# Altium schematic sheet MAIN_SCH.SchDoc
size A; SheetNumber: 1; SheetTotal: 3
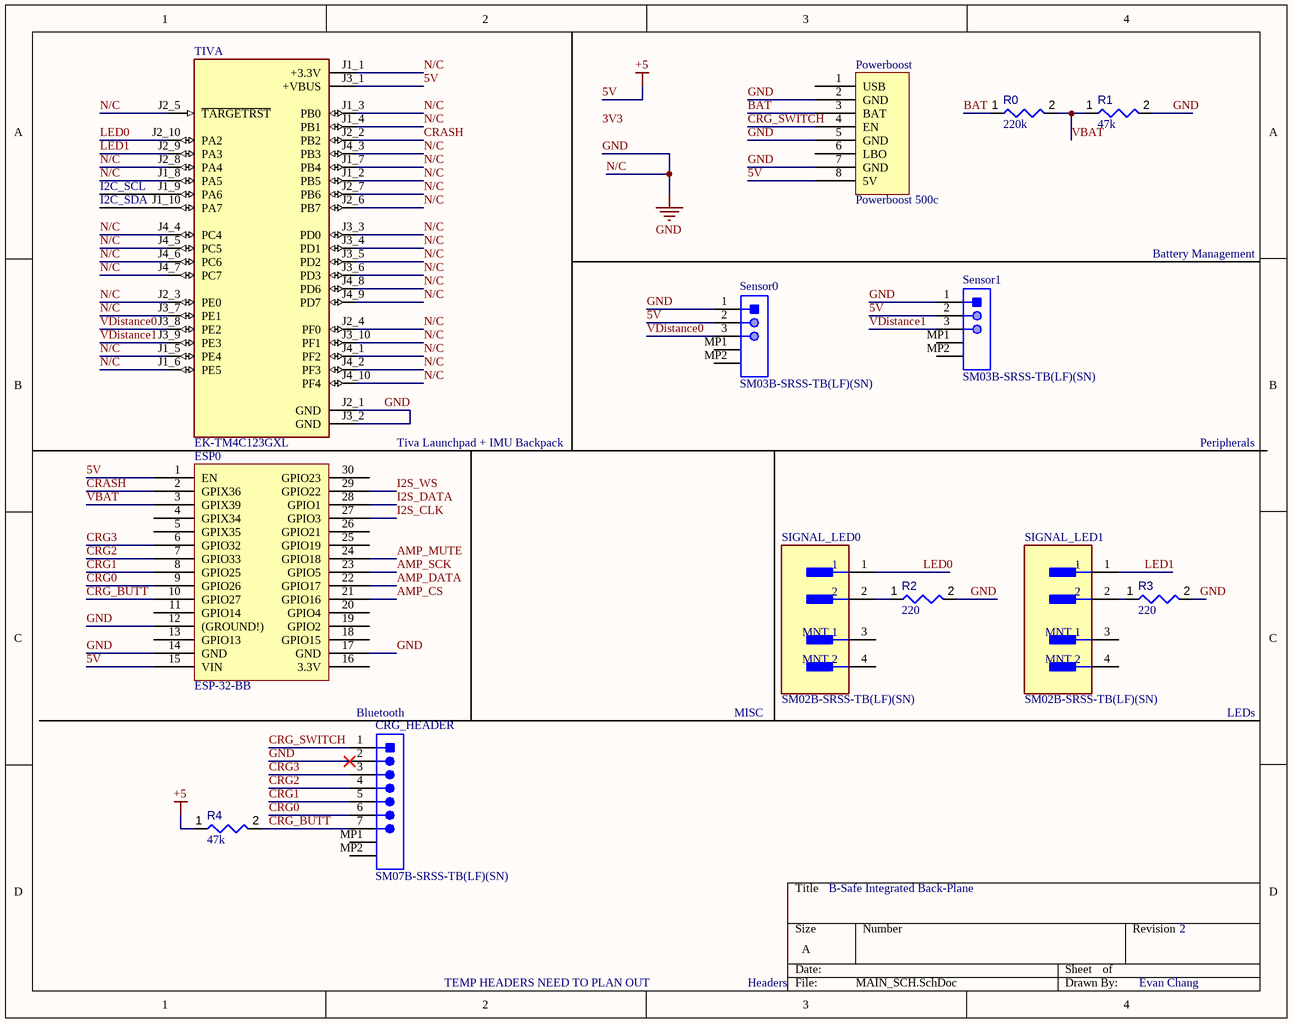
[diagram p0: MAIN_SCH.SchDoc]

## Parts
CRG_HEADER  SM07B-SRSS-TB(LF)(SN)  [JST-SM07B-SRSS-TB_V]
ESP0  ESP-32-BB  [ESP-32-BB-Footprint-1]
Powerboost  Powerboost 500c  [Powerboost 500c-Footprint-1]
R0  value 220k  [RESC1005X40X25NL05T10]  (hidden comment: RC0402FR-07220KL)
R1  value 47k  [RESC1005X40X25NL05T10]  (hidden comment: RC0402FR-0747KL)
R2  value 220  [RESC1608X55X30LL20T10]  (hidden comment: RK73B1JTTD221J)
R3  value 220  [RESC1608X55X30LL20T10]  (hidden comment: RK73B1JTTD221J)
R4  value 47k  [RESC1005X40X25NL05T10]  (hidden comment: RC0402FR-0747KL)
Sensor0  SM03B-SRSS-TB(LF)(SN)  [JST-SM03B-SRSS-TB_V]
Sensor1  SM03B-SRSS-TB(LF)(SN)  [JST-SM03B-SRSS-TB_V]
SIGNAL_LED0  SM02B-SRSS-TB(LF)(SN)  [FP-SM02B-SRSS-TB_LF_SN-0]
SIGNAL_LED1  SM02B-SRSS-TB(LF)(SN)  [FP-SM02B-SRSS-TB_LF_SN-0]
TIVA  EK-TM4C123GXL  [EK-TM4C123GXL-Footprint-1]

## Nets
5V: ESP0.1(EN) ESP0.15(VIN) Powerboost.8(5V) R4.1 Sensor0.2 Sensor1.2 TIVA.J3_1(+VBUS)  [also labelled +5]
GND: CRG_HEADER.2 ESP0.12((GROUND!)) ESP0.14(GND) ESP0.17(GND) Powerboost.2(GND) Powerboost.5(GND) Powerboost.7(GND) R1.2 R2.2 R3.2 Sensor0.1 Sensor1.1 TIVA.J1_1(+3.3V) TIVA.J1_2(PB5) TIVA.J1_3(PB0) TIVA.J1_4(PB1) TIVA.J1_5(PE4) TIVA.J1_6(PE5) TIVA.J1_7(PB4) TIVA.J1_8(PA5) TIVA.J2_1(GND) TIVA.J2_3(PE0) TIVA.J2_4(PF0) TIVA.J2_5(~{TARGETRST}) TIVA.J2_6(PB7) TIVA.J2_7(PB6) TIVA.J2_8(PA4) TIVA.J3_2(GND) TIVA.J3_3(PD0) TIVA.J3_4(PD1) TIVA.J3_5(PD2) TIVA.J3_6(PD3) TIVA.J3_7(PE1) TIVA.J3_10(PF1) TIVA.J4_1(PF2) TIVA.J4_2(PF3) TIVA.J4_3(PB3) TIVA.J4_4(PC4) TIVA.J4_5(PC5) TIVA.J4_6(PC6) TIVA.J4_7(PC7) TIVA.J4_8(PD6) TIVA.J4_9(PD7) TIVA.J4_10(PF4)  [also labelled N/C]
AMP_CS: ESP0.21(GPIO16)
AMP_DATA: ESP0.22(GPIO17)
AMP_MUTE: ESP0.24(GPIO18)
AMP_SCK: ESP0.23(GPIO5)
BAT: Powerboost.3(BAT) R0.1
CRASH: ESP0.2(GPIX36) TIVA.J2_2(PB2)
CRG0: CRG_HEADER.6 ESP0.9(GPIO26)
CRG1: CRG_HEADER.5 ESP0.8(GPIO25)
CRG2: CRG_HEADER.4 ESP0.7(GPIO33)
CRG3: CRG_HEADER.3 ESP0.6(GPIO32)
CRG_BUTT: CRG_HEADER.7 ESP0.10(GPIO27) R4.2
CRG_SWITCH: CRG_HEADER.1 Powerboost.4(EN)
I2S_CLK: ESP0.27(GPIO3)
I2S_DATA: ESP0.28(GPIO1)
I2S_WS: ESP0.29(GPIO22)
LED0: SIGNAL_LED0.1 TIVA.J2_10(PA2)
LED1: SIGNAL_LED1.1 TIVA.J2_9(PA3)
VBAT: ESP0.3(GPIX39) R0.2 R1.1
VDistance0: Sensor0.3 TIVA.J3_8(PE2)
VDistance1: Sensor1.3 TIVA.J3_9(PE3)
NetR2_1: R2.1 SIGNAL_LED0.2
NetR3_1: R3.1 SIGNAL_LED1.2

Not connected (* = marked no-connect by the designer): CRG_HEADER MP1 MP2; ESP0 4(GPIX34) 5(GPIX35) 11(GPIO14) 13(GPIO13) 16(3.3V) 18(GPIO15) 19(GPIO2) 20(GPIO4) 25(GPIO19) 26(GPIO21) 30(GPIO23); Powerboost 1(USB) 6(LBO); Sensor0 MP1 MP2; Sensor1 MP1 MP2; SIGNAL_LED0 3(MNT_1) 4(MNT_2); SIGNAL_LED1 3(MNT_1) 4(MNT_2); TIVA J1_9(PA6) J1_10(PA7)

## Notes on the sheet
- (near TIVA) I2C_SCL
- (near TIVA) I2C_SDA
- Battery Management
- Tiva Launchpad + IMU Backpack
- Peripherals
- (near CRG_HEADER) Bluetooth
- MISC
- LEDs
- B-Safe Integrated Back-Plane
- 2
- TEMP HEADERS NEED TO PLAN OUT
- Headers
- Evan Chang
- Labels drawn without touching a wire or pin: 3V3

## Library data of the parts
CRG_HEADER = CMP-002-00071-1: CONN HEADER SH 7POS SIDE 1MM TIN; Pins: 7
ESP0 = CMP-00001-11: Breakoutboard for ESP-32-BB
Powerboost = CMP-00002-5: Breakout board component for Adafruit Powerboost 500c
R0 = CMP-009-00179-2: Fixed Resistor, Metal Glaze/thick Film, 0.0625W, 220000ohm, 50V, 1% +/-Tol, 100ppm/Cel, Surface Mount, 0402; Min Operating Temperature: -55°C; Max Operating Temperature: 155°C; RoHS Compliant: Yes; Tolerance: 1%
R1 R4 = CMP-009-00178-2: Fixed Resistor, Metal Glaze/thick Film, 0.0625W, 47000ohm, 50V, 1% +/-Tol, 100ppm/Cel, Surface Mount, 0402; RoHS Compliant: Yes; Min Operating Temperature: -55°C; Max Operating Temperature: 155°C; Tolerance: 1%
R2 R3 = CMP-009-00180-2: Fixed Resistor, Metal Glaze/thick Film, 0.125W, 220ohm, 75V, 5% +/-Tol, 200ppm/Cel, Surface Mount, 0603; Max Operating Temperature: 155°C; RoHS Compliant: Yes; Tolerance: 5%; Min Operating Temperature: -55°C
Sensor0 Sensor1 = CMP-002-00074-1: CONN HEADER SH 3POS SIDE 1MM TIN; Pins: 3
SIGNAL_LED0 SIGNAL_LED1 = CMP-002-00072-1: CONN HEADER SH 2POS SIDE 1MM TIN; Pins: 2
TIVA = CMP-012-000000-3: ARMÂ® CortexÂ®-M4F Based MCU TM4C123G LaunchPadâ„¢ Evaluation Kit; MF: Texas Instruments; Design Item ID: EK-TM4C123GXL; SnapEDA_Link: https://www.snapeda.com/parts/EK-TM4C123GXL/Texas%20Instruments/view-part/132968/?ref=snap; Availability: Warning; Check_prices: https://www.snapeda.com/parts/EK-TM4C123GXL/Texas%20Instruments/view-part/132968/?ref=eda; Price: None; Component Type: Standard; Pin Count: 40; MP: EK-TM4C123GXL; Purchase-URL: https://pricing.snapeda.com/search/part/EK-TM4C123GXL/?ref=eda; Package: None; Source: EK-TM4C123GXL.SchLib; Value: *